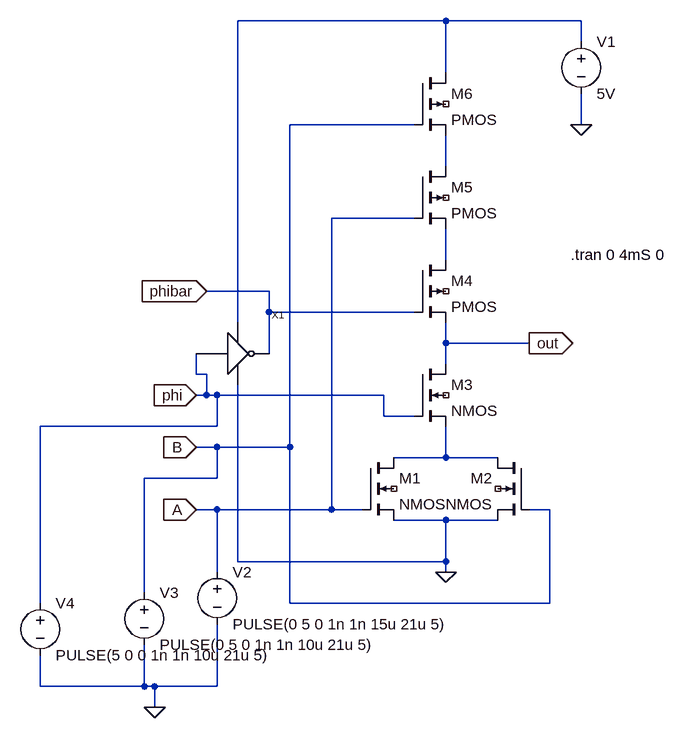
[diagram p0: schematic c2MOS_NOR.asc]
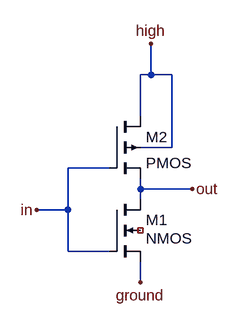
[diagram p1: sub-circuit not.asc]
c2MOS_NOR.asc, the LTspice schematic file:
Version 4
SHEET 1 880 964
WIRE -160 -160 -480 -160
WIRE 48 -160 -160 -160
WIRE 48 -128 48 -160
WIRE -160 -80 -160 -160
WIRE -208 0 -400 0
WIRE 48 0 48 -48
WIRE -160 64 -160 16
WIRE -208 144 -336 144
WIRE -160 208 -160 160
WIRE -432 256 -528 256
WIRE -432 288 -432 256
WIRE -208 288 -432 288
WIRE -480 304 -480 -160
WIRE -160 336 -160 304
WIRE -32 336 -160 336
WIRE -432 352 -432 288
WIRE -160 368 -160 336
WIRE -544 384 -544 352
WIRE -528 384 -544 384
WIRE -528 416 -528 384
WIRE -528 416 -544 416
WIRE -512 416 -528 416
WIRE -256 416 -512 416
WIRE -256 448 -256 416
WIRE -208 448 -256 448
WIRE -512 464 -512 416
WIRE -512 464 -784 464
WIRE -512 496 -544 496
WIRE -400 496 -400 0
WIRE -400 496 -512 496
WIRE -160 512 -160 464
WIRE -160 512 -240 512
WIRE -80 512 -160 512
WIRE -512 544 -512 496
WIRE -512 544 -624 544
WIRE -512 592 -544 592
WIRE -336 592 -336 144
WIRE -336 592 -512 592
WIRE -288 592 -336 592
WIRE 0 592 -32 592
WIRE -160 608 -240 608
WIRE -80 608 -160 608
WIRE -480 672 -480 400
WIRE -160 672 -160 608
WIRE -160 672 -480 672
WIRE -512 688 -512 592
WIRE -160 688 -160 672
WIRE -624 720 -624 544
WIRE -784 736 -784 464
WIRE -400 736 -400 496
WIRE 0 736 0 592
WIRE 0 736 -400 736
WIRE -784 864 -784 816
WIRE -624 864 -624 800
WIRE -624 864 -784 864
WIRE -608 864 -624 864
WIRE -512 864 -512 768
WIRE -512 864 -608 864
WIRE -608 896 -608 864
FLAG -160 688 0
FLAG 48 0 0
FLAG -544 592 A
IOPIN -544 592 In
FLAG -544 496 B
IOPIN -544 496 In
FLAG -544 416 phi
IOPIN -544 416 In
FLAG -528 256 phibar
IOPIN -528 256 In
FLAG -32 336 out
IOPIN -32 336 Out
FLAG -608 896 0
SYMBOL nmos4 -288 512 R0
SYMATTR InstName M1
SYMBOL nmos4 -32 512 M0
SYMATTR InstName M2
SYMBOL nmos4 -208 368 R0
SYMATTR InstName M3
SYMBOL pmos4 -208 208 R0
SYMATTR InstName M4
SYMBOL pmos4 -208 64 R0
SYMATTR InstName M5
SYMBOL pmos4 -208 -80 R0
SYMATTR InstName M6
SYMBOL voltage 48 -144 R0
WINDOW 123 0 0 Left 0
WINDOW 39 0 0 Left 0
SYMATTR InstName V1
SYMATTR Value 5V
SYMBOL NOT -448 352 R0
SYMATTR InstName X1
SYMBOL voltage -512 672 R0
WINDOW 123 0 0 Left 0
WINDOW 39 0 0 Left 0
SYMATTR InstName V2
SYMATTR Value PULSE(0 5 0 1n 1n 15u 21u 5)
SYMBOL voltage -624 704 R0
WINDOW 123 0 0 Left 0
WINDOW 39 0 0 Left 0
SYMATTR InstName V3
SYMATTR Value PULSE(0 5 0 1n 1n 10u 21u 5)
SYMBOL voltage -784 720 R0
WINDOW 123 0 0 Left 0
WINDOW 39 0 0 Left 0
SYMATTR InstName V4
SYMATTR Value PULSE(5 0 0 1n 1n 10u 21u 5)
TEXT 32 200 Left 2 !.tran 0 4mS 0

not.asc, the sub-circuit schematic file:
Version 4
SHEET 1 880 680
WIRE 176 -64 176 -112
WIRE 176 -64 160 -64
WIRE 208 -64 176 -64
WIRE 160 0 160 -64
WIRE 208 48 208 -64
WIRE 208 48 160 48
WIRE 112 80 48 80
WIRE 160 112 160 96
WIRE 240 112 160 112
WIRE 160 128 160 112
WIRE 48 144 48 80
WIRE 48 144 0 144
WIRE 48 208 48 144
WIRE 112 208 48 208
WIRE 160 256 160 224
FLAG 0 144 in
FLAG 240 112 out
FLAG 160 256 ground
FLAG 176 -112 high
SYMBOL nmos4 112 128 R0
WINDOW 3 56 60 Left 2
SYMATTR InstName M1
SYMBOL pmos4 112 0 R0
SYMATTR InstName M2

The netlist it stands for:
* c2MOS_NOR.asc
M1 N004 A 0 NC_01 NMOS
M2 N004 B 0 NC_02 NMOS
M3 out phi N004 NC_03 NMOS
M4 N003 phibar out NC_04 PMOS
M5 N002 A N003 NC_05 PMOS
M6 N001 B N002 NC_06 PMOS
V1 N001 0 5V
XX1 phi phibar N001 0 not
V2 A 0 PULSE(0 5 0 1n 1n 15u 21u 5)
V3 B 0 PULSE(0 5 0 1n 1n 10u 21u 5)
V4 phi 0 PULSE(5 0 0 1n 1n 10u 21u 5)

* block symbol definitions
.subckt not in out high ground
M1 out in ground NC_01 NMOS
M2 high in out high PMOS
.ends not

.model NMOS NMOS
.model PMOS PMOS
.lib standard.mos
.tran 0 4mS 0
.backanno
.end